# Altium schematic sheet Nixiewatch.SchDoc
size A2
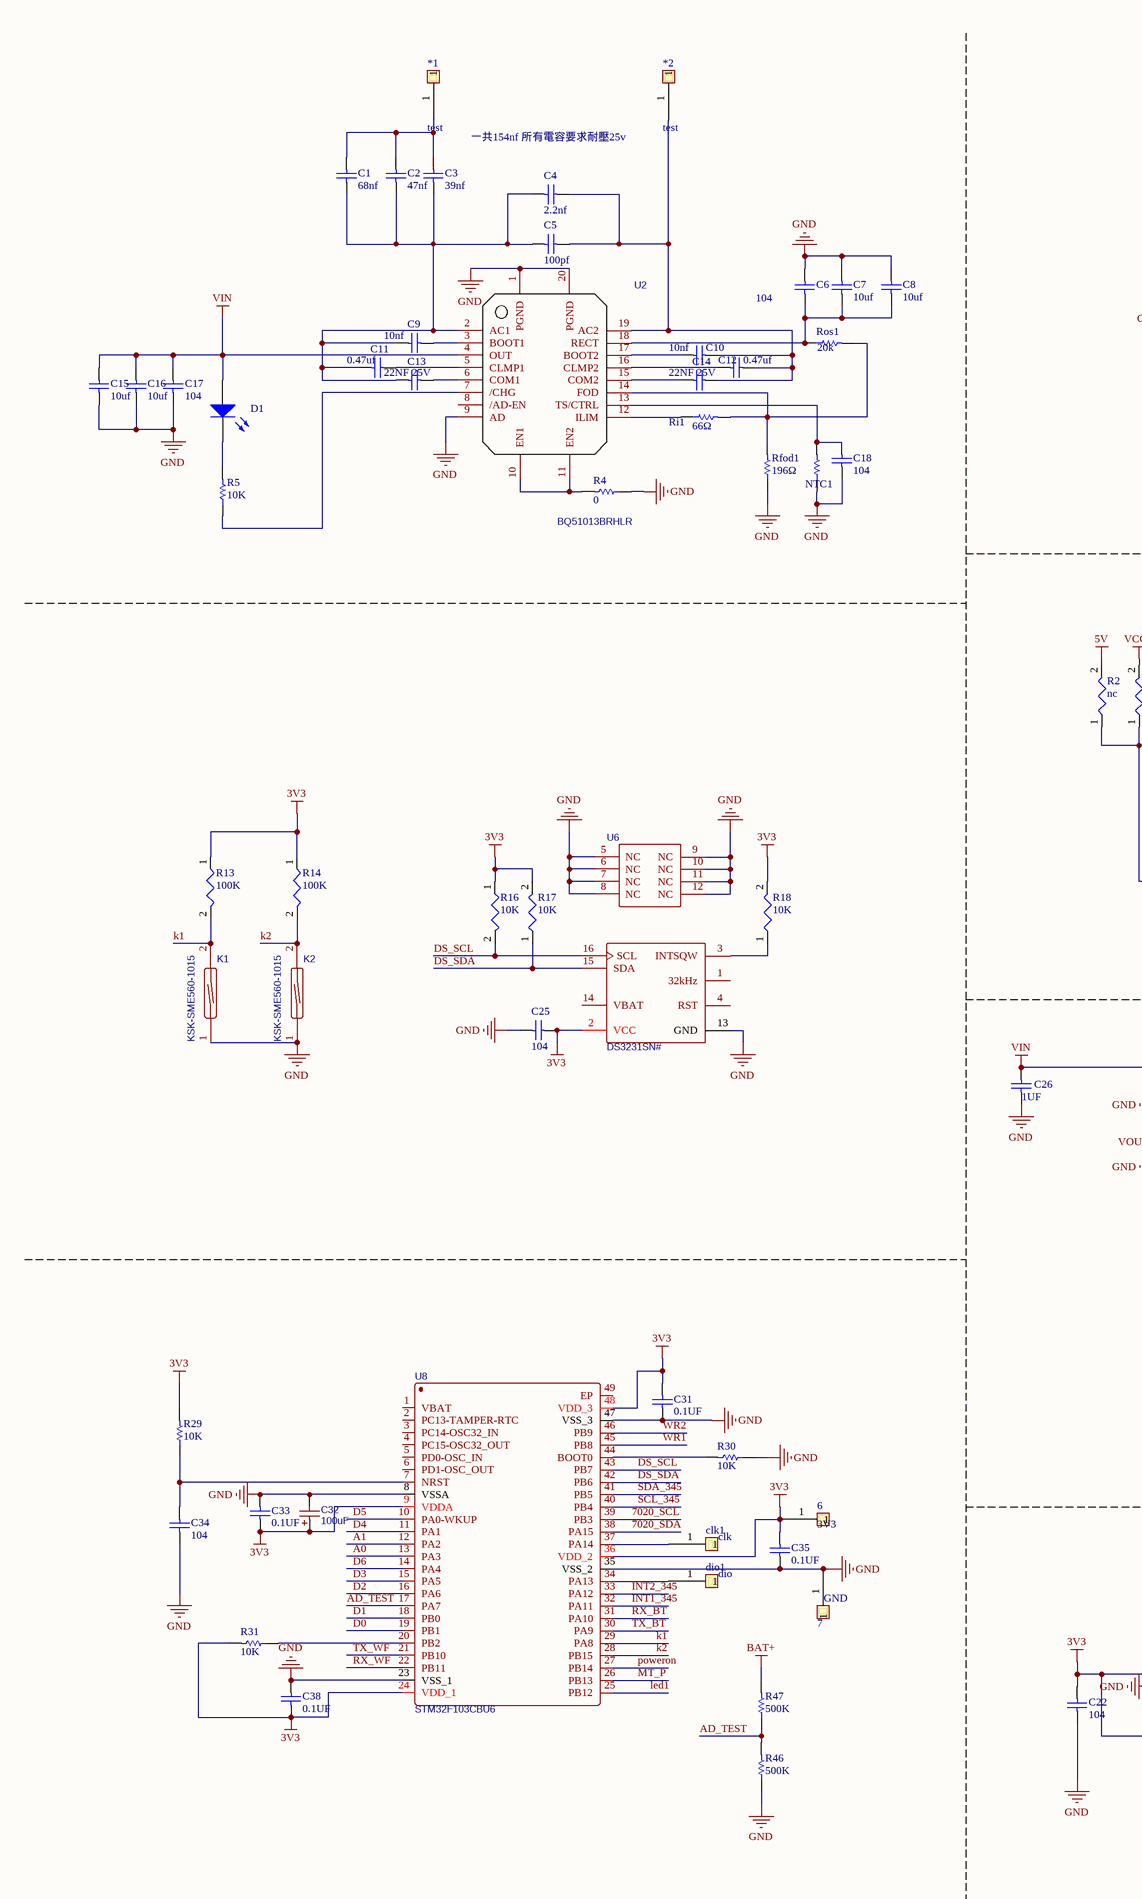
[diagram p0: Nixiewatch.SchDoc, left]
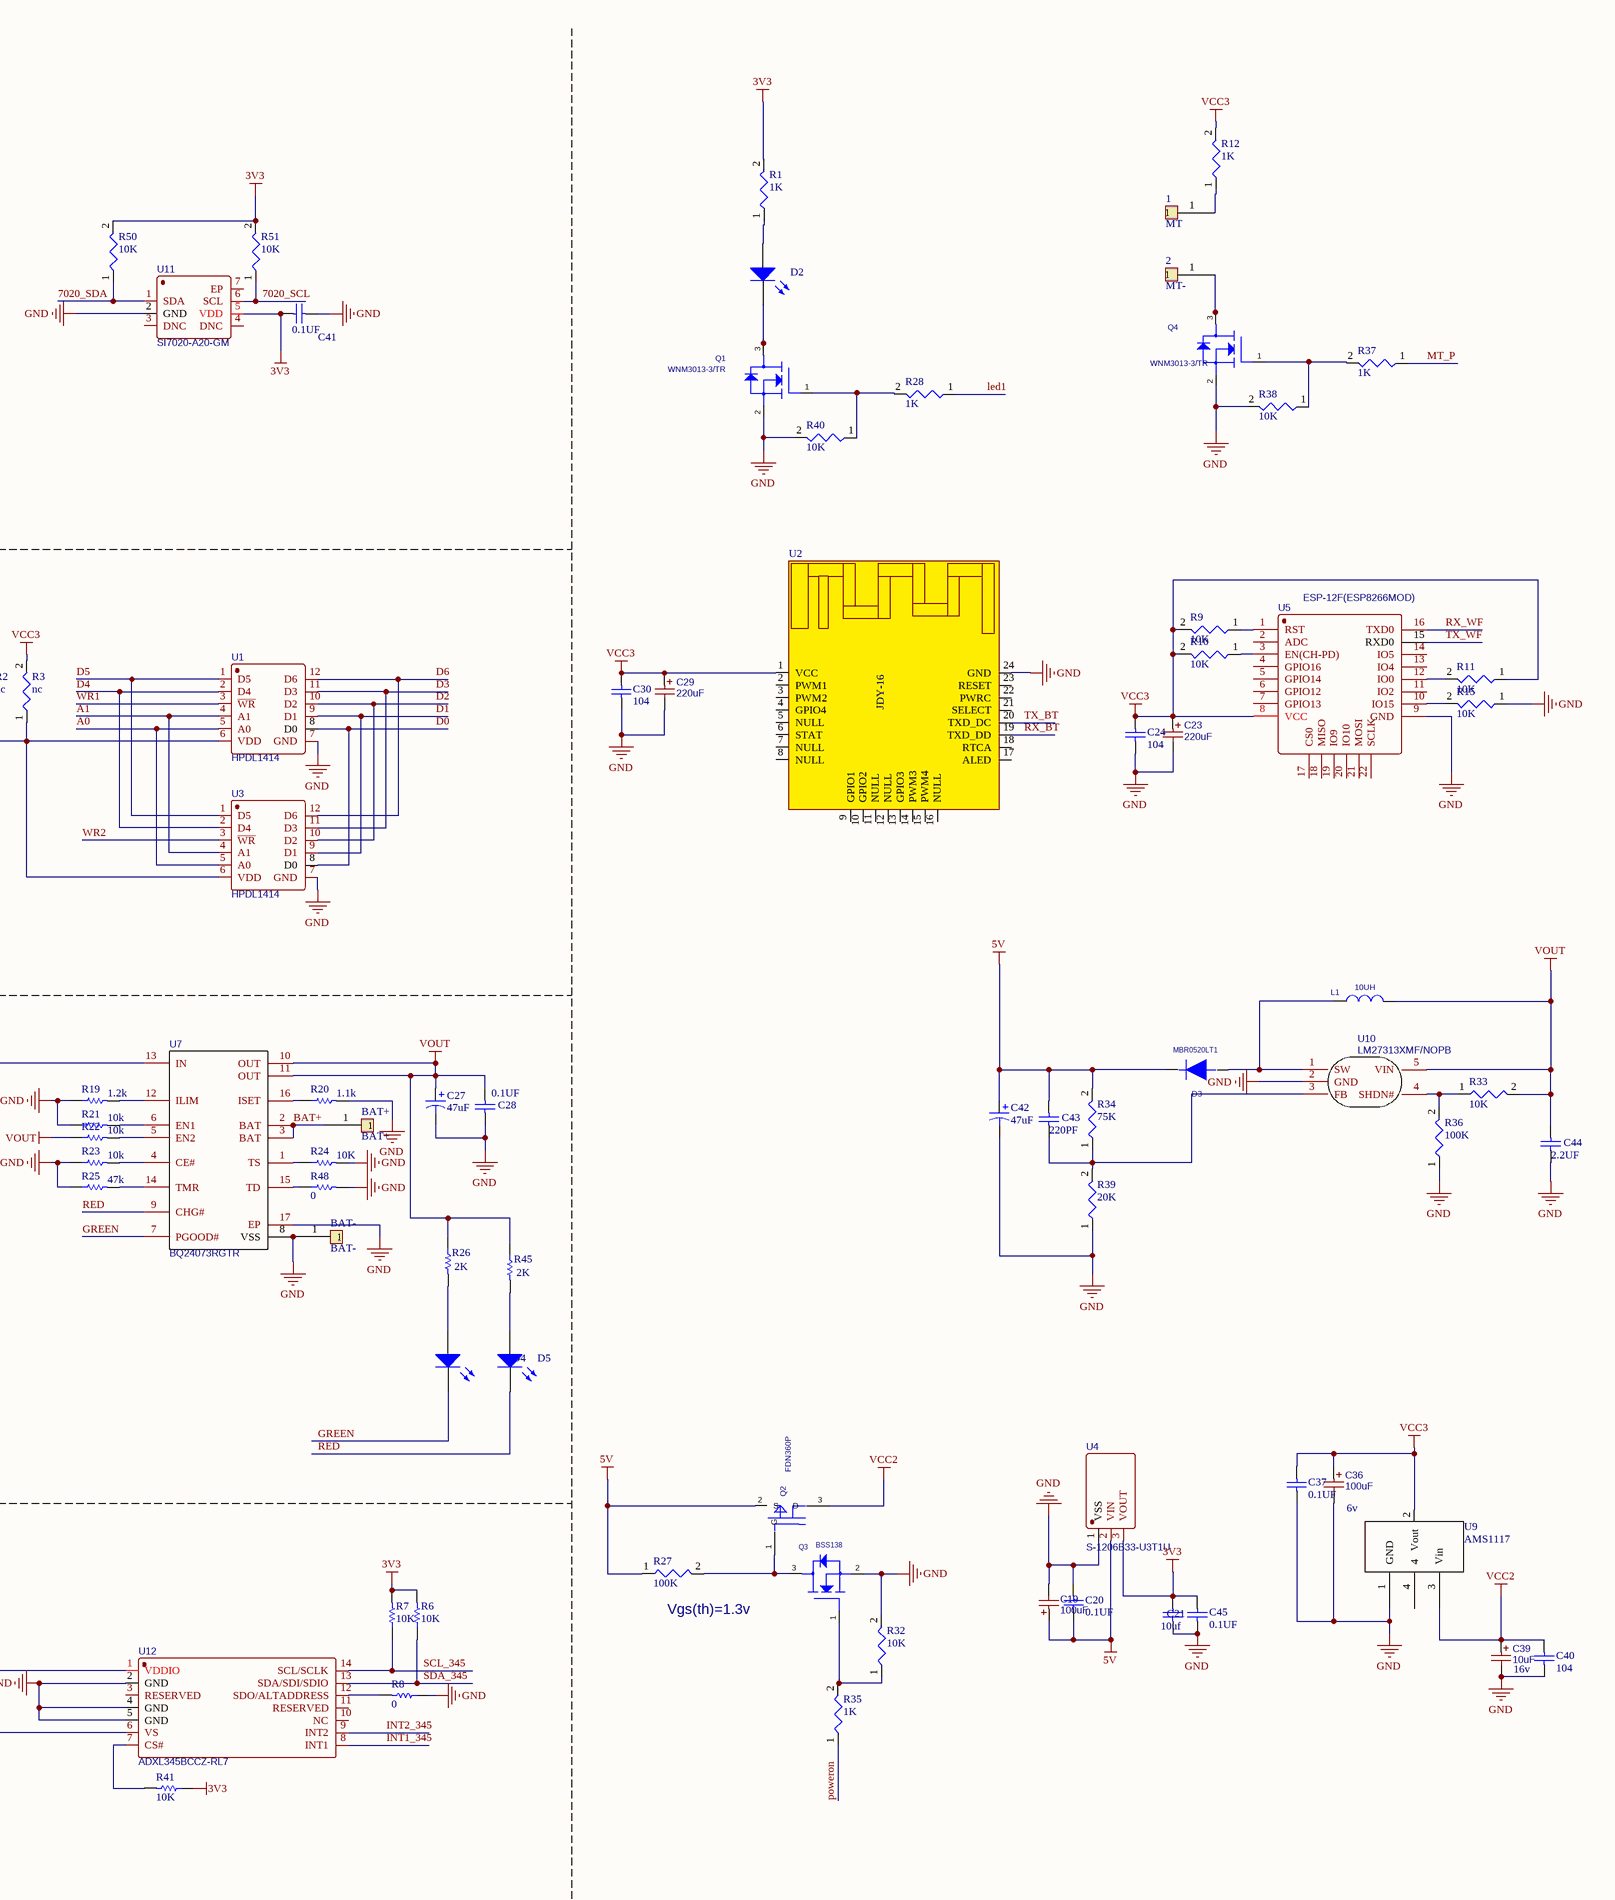
[diagram p1: Nixiewatch.SchDoc, right]

## Parts
1  MT  [测试点圆]
2  MT-  [测试点圆]
6  3V3  [测试点圆]
7  GND  [测试点圆]
*1  test  [测试点圆]
*2  test  [测试点圆]
?  U2  [JDY-16]
BAT+  BAT+  [测试点圆]
BAT-  BAT-  [测试点圆]
C1  value 68nf  [C_0402]  (hidden comment: 104)
C2  value 47nf  [C_0402]  (hidden comment: 104)
C3  value 39nf  [C_0402]  (hidden comment: 104)
C4  value 2.2nf  [C_0402]  (hidden comment: 104)
C5  value 100pf  [C0201]  (hidden comment: 104)
C6  104  [C_0402]
C7  value 10uf  [C_0402]  (hidden comment: 104)
C8  value 10uf  [C_0402]  (hidden comment: 104)
C9  value 10nf  [C_0402]  (hidden comment: 104)
C10  value 10nf  [C_0402]  (hidden comment: 104)
C11  value 0.47uf  [C_0402]  (hidden comment: 104)
C12  value 0.47uf  [C_0402]  (hidden comment: 104)
C13  value 22NF 25V  [C_0402]  (hidden comment: 104)
C14  value 22NF 25V  [C_0402]  (hidden comment: 104)
C15  value 10uf  [C_0402]  (hidden comment: 104)
C16  value 10uf  [C_0402]  (hidden comment: 104)
C17  104  [C_0402]
C18  104  [C0201]
C19  100uF  [100ufA3216]
C20  value 0.1UF  [C0201]  (hidden comment: 104)
C21  10uf  [C_0402]
C22  104  [C0201]
C23  220uF  [B3528]
C24  104  [C0201]
C25  104  [C0201]
C26  value 1UF  [C_0402]  (hidden comment: 104)
C27  value 47uF  [100ufA3216]  (hidden comment: Cap Pol1)
C28  value 0.1UF  [C0201]  (hidden comment: 104)
C29  220uF  [B3528]
C30  104  [C0201]
C31  value 0.1UF  [C0201]  (hidden comment: 104)
C32  100uF  [100ufA3216]
C33  value 0.1UF  [C0201]  (hidden comment: 104)
C34  104  [C0201]
C35  value 0.1UF  [C0201]  (hidden comment: 104)
C36  100uF  [100ufA3216]
C37  value 0.1UF  [C0201]  (hidden comment: 104)
C38  value 0.1UF  [C0201]  (hidden comment: 104)
C39  10uF  [100ufA3216]
C40  104  [C0201]
C41  value 0.1UF  [C0201]  (hidden comment: 104)
C42  value 47uF  [100ufA3216]  (hidden comment: Cap Pol1)
C43  value 220PF  [C0201]  (hidden comment: 104)
C44  value 2.2UF  [C_0402]  (hidden comment: 104)
C45  value 0.1UF  [C0201]  (hidden comment: 104)
clk1  clk  [测试点圆]
D1  LED0  [LED0402-R-RD]  (value not drawn)
D2  LED0  [LED-TH_BD3.0-P2.54-FD]  (value not drawn)
D3  MBR0520LT1  [SOD-123]
D4  LED0  [LED-TH_BD3.0-P2.54-FD]  (value not drawn)
D5  LED0  [LED0402-R-RD]  (value not drawn)
dio1  dio  [测试点圆]
K1  KSK-SME560-1015  [DIP-TH_KSK-SME560-1015]
K2  KSK-SME560-1015  [DIP-TH_KSK-SME560-1015]
L1  value 10UH  [IND_2016]  (hidden comment: 2520L_0.68UH)
NTC1  Res1  [R0201]  (value not drawn)
Q1  value WNM3013-3/TR  [SOT_723]  (hidden comment: 2N7002/SOT_1)
Q2  FDN360P  [LC-SOT-23(SOT-23-3)]
Q3  value BSS138  [BSS138]  (hidden comment: 2N7002/SOT_1)
Q4  value WNM3013-3/TR  [SOT_723]  (hidden comment: 2N7002/SOT_1)
R1  1K  [R0201]
R2  nc  [R_0402]
R3  nc  [R_0402]
R4  value 0  [R0201]  (hidden comment: Res1)
R5  value 10K  [R0201]  (hidden comment: Res1)
R6  value 10K  [R0201]  (hidden comment: Res1)
R7  value 10K  [R0201]  (hidden comment: Res1)
R8  value 0  [R0201]  (hidden comment: Res1)
R9  10K  [R0201]
R10  10K  [R0201]
R11  10K  [R0201]
R12  1K  [R0201]
R13  100K  [R0201]
R14  100K  [R0201]
R15  10K  [R0201]
R16  10K  [R0201]
R17  10K  [R0201]
R18  10K  [R0201]
R19  value 1.2k  [R0201]  (hidden comment: Res1)
R20  value 1.1k  [R0201]  (hidden comment: Res1)
R21  value 10k  [R0201]  (hidden comment: Res1)
R22  value 10k  [R0201]  (hidden comment: Res1)
R23  value 10k  [R0201]  (hidden comment: Res1)
R24  value 10K  [R0201]  (hidden comment: Res1)
R25  value 47k  [R0201]  (hidden comment: Res1)
R26  value 2K  [R0201]  (hidden comment: Res1)
R27  100K  [R0201]
R28  1K  [R0201]
R29  value 10K  [R0201]  (hidden comment: Res1)
R30  value 10K  [R0201]  (hidden comment: Res1)
R31  value 10K  [R0201]  (hidden comment: Res1)
R32  10K  [R0201]
R33  10K  [R0201]
R34  75K  [R0201]
R35  1K  [R0201]
R36  100K  [R0201]
R37  1K  [R0201]
R38  10K  [R0201]
R39  20K  [R0201]
R40  10K  [R0201]
R41  value 10K  [R0201]  (hidden comment: Res1)
R45  value 2K  [R0201]  (hidden comment: Res1)
R46  value 500K  [R0201]  (hidden comment: Res1)
R47  value 500K  [R0201]  (hidden comment: Res1)
R48  value 0  [C_0402]  (hidden comment: Res1)
R50  10K  [R0201]
R51  10K  [R0201]
Rfod1  value 196Ω  [R0201]  (hidden comment: Res1)
Ri1  value 66Ω  [R0201]  (hidden comment: Res1)
Ros1  value 20k  [R0201]  (hidden comment: Res1)
U1  HPDL1414  [HPDL1414]
U2  BQ51013BRHLR  [QFN-20_L4.7-W3.7-P0.50-BL-EP]
U3  HPDL1414  [HPDL1414]
U4  S-1206B33-U3T1U  [SOT-89-3_L4.5-W2.5-P1.50-LS4.2-TL]
U5  ESP-12F(ESP8266MOD)  [ESP-12F-ESP8266MOD]
U6  DS3231SN#  [DS3231]
U7  BQ24073RGTR  [BQ24073RGTR]
U8  STM32F103CBU6  [STM32F103CBU6]
U9  AMS1117  [SOT223 LM1117 3.3V]
U10  LM27313XMF/NOPB  [SOT-23-5_L3.0-W1.7-P0.95-LS2.8-BR]
U11  SI7020-A20-GM  [SI7020]
U12  ADXL345BCCZ-RL7  [LGA-14_L5.0-W3.0-P0.80-BL]

## Nets
3V3: 6.1 C21.1 C22.1 C25.2 C31.2 C32.1 C33.1 C35.2 C38.1 C41.1 C45.2 R1.2 R6.2 R7.2 R13.1 R14.1 R16.1 R17.2 R18.2 R29.2 R31.2 R41.1 R50.2 R51.2 U4.3(VOUT) U6.2(VCC) U8.9(VDDA) U8.24(VDD_1) U8.36(VDD_2) U8.48(VDD_3) U11.5(VDD) U12.1(VDDIO) U12.6(VS)
5V: C19.1 C20.1 C42.1 C43.1 D3.1 Q2.2(S) R2.2 R27.1 R34.2 U4.2(VIN)
BAT+: BAT+.1 R47.2 U7.2(BAT) U7.3(BAT)
GND: 7.1 ?.24(GND) BAT-.1 C6.1 C7.1 C8.1 C15.2 C16.2 C17.2 C18.2 C19.2 C20.2 C21.2 C22.2 C23.2 C24.1 C25.1 C26.2 C27.2 C28.2 C29.2 C30.1 C31.1 C32.2 C33.2 C34.2 C35.1 C36.2 C37.1 C38.2 C39.2 C40.1 C41.2 C42.2 C44.2 C45.1 K1.1 K2.1 NTC1.1 Q1.2(SOURCE) Q3.2(SOURCE) Q4.2(SOURCE) R4.1 R8.1 R15.1 R19.1 R20.2 R21.1 R23.1 R24.2 R25.1 R30.1 R32.2 R36.1 R38.2 R39.1 R40.2 R46.1 R48.2 Rfod1.1 U1.7(GND) U2.1(PGND) U2.9(AD) U2.20(PGND) U3.7(GND) U4.1(VSS) U5.9(GND) U6.5(NC) U6.6(NC) U6.7(NC) U6.8(NC) U6.9(NC) U6.10(NC) U6.11(NC) U6.12(NC) U6.13(GND) U7.8(VSS) U7.17(EP) U8.8(VSSA) U8.23(VSS_1) U8.35(VSS_2) U8.47(VSS_3) U9.1(GND) U10.2(GND) U11.2(GND) U12.2(GND) U12.4(GND) U12.5(GND)
VCC2: C39.1 C40.2 Q2.3(D) U9.3(Vin)
VCC3: ?.1(VCC) C23.1 C24.2 C29.1 C30.2 C36.1 C37.2 R3.2 R9.2 R10.2 R11.1 R12.2 U5.8(VCC) U9.2(Vout)
VIN: C15.1 C16.1 C17.1 C26.1 D1.1(A) U2.4(OUT) U7.13(IN)
VOUT: C27.1 C28.1 C44.1 L1.2 R22.1 R26.1 R33.2 R45.1 U7.10(OUT) U7.11(OUT) U10.5(VIN)
7020_SCL: R51.1 U8.39(PB3) U11.6(SCL)
7020_SDA: R50.1 U8.38(PA15) U11.1(SDA)
A0: U1.5(A0) U3.5(A0) U8.13(PA3)
A1: U1.4(A1) U3.4(A1) U8.12(PA2)
AD_TEST: R46.2 R47.1 U8.17(PA7)
D0: U1.8(D0) U3.8(D0) U8.19(PB1)
D1: U1.9(D1) U3.9(D1) U8.18(PB0)
D2: U1.10(D2) U3.10(D2) U8.16(PA6)
D3: U1.11(D3) U3.11(D3) U8.15(PA5)
D4: U1.2(D4) U3.2(D4) U8.11(PA1)
D5: U1.1(D5) U3.1(D5) U8.10(PA0-WKUP)
D6: U1.12(D6) U3.12(D6) U8.14(PA4)
DS_SCL: R16.2 U6.16(SCL) U8.43(PB7)
DS_SDA: R17.1 U6.15(SDA) U8.42(PB6)
GREEN: D4.2(K) U7.7(PGOOD#)
INT1_345: U8.32(PA11) U12.8(INT1)
INT2_345: U8.33(PA12) U12.9(INT2)
k1: K1.2 R13.2 U8.29(PA8)
k2: K2.2 R14.2 U8.28(PB15)
led1: R28.1 U8.25(PB12)
MT_P: R37.1 U8.26(PB13)
poweron: R35.1 U8.27(PB14)
RED: D5.2(K) U7.9(CHG#)
RX_BT: ?.19(TXD_DD) U8.31(PA10)
RX_WF: U5.16(TXD0) U8.22(PB11)
SCL_345: R7.1 U8.40(PB4) U12.14(SCL/SCLK)
SDA_345: R6.1 U8.41(PB5) U12.13(SDA/SDI/SDIO)
TX_BT: ?.20(TXD_DC) U8.30(PA9)
TX_WF: U5.15(RXD0) U8.21(PB10)
WR1: U1.3(~{WR}) U8.45(PB8)
WR2: U3.3(~{WR}) U8.46(PB9)
Net1_1: 1.1 R12.1
Net2_1: 2.1 Q4.3(DRAIN)
Net*1_1: *1.1 C1.1 C2.1 C3.1
Net*2_1: *2.1 C4.1 C5.1 C10.1 C12.1 C14.1 U2.19(AC2)
NetC1_2: C1.2 C2.2 C3.2 C4.2 C5.2 C9.2 C11.2 C13.2 U2.2(AC1)
NetC6_2: C6.2 C7.2 C8.2 Ros1.1 U2.18(RECT)
NetC9_1: C9.1 U2.3(BOOT1)
NetC10_2: C10.2 U2.17(BOOT2)
NetC11_1: C11.1 U2.5(CLMP1)
NetC12_2: C12.2 U2.16(CLMP2)
NetC13_1: C13.1 U2.6(COM1)
NetC14_2: C14.2 U2.15(COM2)
NetC18_1: C18.1 NTC1.2 U2.13(TS/CTRL)
NetC34_1: C34.1 R29.1 U8.7(NRST)
NetC43_2: C43.2 R34.1 R39.2 U10.3(FB)
Netclk1_1: clk1.1 U8.37(PA14)
NetD1_2: D1.2(K) R5.2
NetD2_1: D2.1(A) R1.1
NetD2_2: D2.2(K) Q1.3(DRAIN)
NetD3_2: D3.2 L1.1 U10.1(SW)
NetD4_1: D4.1(A) R26.2
NetD5_1: D5.1(A) R45.2
Netdio1_1: dio1.1 U8.34(PA13)
NetQ1_1: Q1.1(GATE) R28.2 R40.1
NetQ2_1: Q2.1(G) Q3.3(DRAIN) R27.2
NetQ3_1: Q3.1(GATE) R32.1 R35.2
NetQ4_1: Q4.1(GATE) R37.2 R38.1
NetR2_1: R2.1 R3.1 U1.6(VDD) U3.6(VDD)
NetR4_2: R4.2 U2.10(EN1) U2.11(EN2)
NetR5_1: R5.1 U2.7(/CHG)
NetR8_2: R8.2 U12.12(SDO/ALTADDRESS)
NetR9_1: R9.1 U5.1(RST)
NetR10_1: R10.1 U5.3(EN(CH-PD))
NetR11_2: R11.2 U5.12(IO0)
NetR15_2: R15.2 U5.10(IO15)
NetR18_1: R18.1 U6.3(INTSQW)
NetR19_2: R19.2 U7.12(ILIM)
NetR20_1: R20.1 U7.16(ISET)
NetR21_2: R21.2 U7.6(EN1)
NetR22_2: R22.2 U7.5(EN2)
NetR23_2: R23.2 U7.4(CE#)
NetR24_1: R24.1 U7.1(TS)
NetR25_2: R25.2 U7.14(TMR)
NetR30_2: R30.2 U8.44(BOOT0)
NetR31_1: R31.1 U8.20(PB2)
NetR33_1: R33.1 R36.2 U10.4(SHDN#)
NetR41_2: R41.2 U12.7(CS#)
NetR48_1: R48.1 U7.15(TD)
NetRfod1_2: Rfod1.2 Ri1.2 Ros1.2 U2.14(FOD)
NetRi1_1: Ri1.1 U2.12(ILIM)

Not connected (* = marked no-connect by the designer): ? 2(PWM1) 3(PWM2) 4(GPIO4) 5(NULL) 6(STAT) 7(NULL) 8(NULL) 9(GPIO1) 10(GPIO2) 11(NULL) 12(NULL) 13(GPIO3) 14(PWM3) 15(PWM4) 16(NULL) 17(ALED) 18(RTCA) 21(SELECT) 22(PWRC) 23(RESET); U2 8(/AD-EN); U5 2(ADC) 4(GPIO16) 5(GPIO14) 6(GPIO12) 7(GPIO13) 11(IO2) 13(IO4) 14(IO5) 17(CS0) 18(MISO) 19(IO9) 20(IO10) 21(MOSI) 22(SCLK); U6 1(32kHz) 4(RST) 14(VBAT); U8 1(VBAT) 2(PC13-TAMPER-RTC) 3(PC14-OSC32_IN) 4(PC15-OSC32_OUT) 5(PD0-OSC_IN) 6(PD1-OSC_OUT) 49(EP); U9 4; U11 3(DNC) 4(DNC) 7(EP); U12 3(RESERVED) 10(NC) 11(RESERVED)

## Notes on the sheet
- 一共154nf 所有電容要求耐壓25v
- (near C36) 6v
- (near R27) Vgs(th)=1.3v
- 16v
- Title
- Size:
- Date:
- File:
- A2
- Number:
- Time:
- Revision:
- Sheet
- of
- (in symbol CC2541-MOD) JDY-16

## Library data of the parts
1 2 6 7 BAT+ BAT- clk1 dio1 = test
? = CC2541-MOD
C1-C18 C20-C22 C24-C26 C28 C30 C31 C33-C35 C37 C38 C40 C41 C43-C45 = Cap: Capacitor; Published: 8-Jun-2000; LatestRevisionDate: 17-Jul-2002; LatestRevisionNote: Re-released for DXP Platform.; PackageReference: RAD-0.3; Publisher: Altium Limited; PackageDescription: Radial Cap, Thru-Hole; 2 Leads; 0.3 in Pin Spacing
  C6 C17 C18 C22 C24 C25 C30 C34 C40: Value: 104
  C21: Value: 10uf
C19 C23 C29 C32 C36 C39 = 22uF: BOM_Manufacturer: Sunlord; BOM_Manufacturer Part: TC212A226K010A; nameAlias: Capacitance; Contributor: LCSC; SMT Type: Extend; BOM_Supplier: LCSC; BOM_Supplier Part: C123296; BOM_LCSC Assembly: Yes; spicePre: C; spiceSymbolName: TC212A226K010A
C27 C42 = Cap Pol1: Polarized Capacitor (Radial); Published: 8-Jun-2000; LatestRevisionDate: 17-Jul-2002; LatestRevisionNote: Re-released for DXP Platform.; PackageReference: RB7.6-15; Publisher: Altium Limited; PackageDescription: Polarized Capacitor (Radial); 2 Leads
D1 D2 D4 D5 = LED0: Typical INFRARED GaAs LED; Published: 8-Jun-2000; LatestRevisionDate: 08-Jul-2005; LatestRevisionNote: Mech Layer 1 removed.; PackageReference: LED-0; Publisher: Altium Limited; PackageDescription: LED; 2 Leads
D3 = MBR0520LT1: Manufacturer #1: ON; ASSEMBLY: SMT; Geometry Height: 2.5MM; Geometry.Height: 1.35mm; R3 Number: HV1000101; PCB DECAL: SOD-123; Value: MBR0520LT1; Part Number: MBR0520LT1; Manufacturer: ON
K1 K2 = KSK-SME560-1015: BOM_Manufacturer: STANDEXMEDER; Contributor: LCSC; BOM_Supplier: LCSC; BOM_Supplier Part: C575284; BOM_Manufacturer Part: KSK-SME560-1015; spicePre: K; spiceSymbolName: KSK-SME560-1015
L1 = 2520L_0.68UH: Power Inductor,22uH,+/-20%,2520; Manufacturer: TDK; Part Number: SWPA252012S220MT; R3 Number: HL900226M; ASSEMBLY: SMT; Geometry.Height: 1.1MM; PCB DECAL: IND_2016
NTC1 R4-R8 R19-R26 R29-R31 R41 R45-R48 Rfod1 Ri1 Ros1 = Res1: Resistor; Published: 8-Jun-2000; LatestRevisionDate: 17-Jul-2002; LatestRevisionNote: Re-released for DXP Platform.; PackageReference: AXIAL-0.3; Publisher: Altium Limited; PackageDescription: Axial Device, Thru-Hole; 2 Leads; 0.3 in Pin Spacing
Q1 Q4 = 2N7002/SOT_1: WILL WNM3013  N-Channel MOSFET 30V, 0.10A, SOT-723; Geometry.Height: 0.5MM; R3 Number: HD1003013; PCB DECAL: SOT_723; Manufacturer: WILL; Part Number: WNM3013-3/TR
Q2 = FDN360P: n-mos; Part Number: BSS138; Manufacturer #1: infineon; Geometry.Height: 1.3mm; PCB DECAL: LC-SOT-23(SOT-23-3)
Q3 = 2N7002/SOT_1: WILL WNM3013  N-Channel MOSFET 30V, 0.10A, SOT-723; Part Number: WNM3013-3/TR; Geometry.Height: 0.5MM; R3 Number: HD1003013; PCB DECAL: BSS138; Manufacturer: WILL
R1-R3 R9-R18 R27 R28 R32-R40 R50 R51 = ?K
U1 U3 = HPDL1414: BOM_Manufacturer: TI; BOM_Manufacturer Part: SN74LS145DR; SMT Type: Extend; BOM_Supplier: LCSC; BOM_Supplier Part: C60829; BOM_LCSC Assembly: Yes; spicePre: U
U2 = BQ51013BRHLR: BOM_Manufacturer: TI; SMT Type: Extend; BOM_Supplier: LCSC; BOM_Manufacturer Part: BQ51013BRHLR; image: //image.lceda.cn/szlcsc/C55663.jpg; BOM_Supplier Part: C55663; BOM_LCSC Assembly: Yes; spicePre: U; spiceSymbolName: BQ51013BRHLR
U4 = S-1206B33-U3T1U: BOM_Manufacturer: SEIKO; Current - Output: 250mA; Voltage - Input (Max): 6.5V; Contributor: LCSC; SMT Type: Extend; BOM_Supplier: LCSC; BOM_Manufacturer Part: S-1206B33-U3T1U; BOM_Supplier Part: C155188; BOM_LCSC Assembly: Yes; spicePre: U; spiceSymbolName: S-1206B33-U3T1U
U5 = ESP-12F(ESP8266MOD): BOM_Manufacturer: Ai-Thinker; BOM_Supplier: LCSC; BOM_Manufacturer Part: ESP-12F(ESP8266MOD); BOM_Supplier Part: C82891; spicePre: U; spiceSymbolName: ESP-12F(ESP8266MOD)
U6 = DS3231SN#: BOM_Manufacturer: MAXIM; subpart_no: 1; tags: Clock; BOM_Supplier Part: C9866; BOM_Supplier: LCSC; BOM_Manufacturer Part: DS3231SN; image: http://image.lceda.cn/szlcsc/C9866.jpg; spicePre: U
U7 = BQ24073RGTR: BOM_Manufacturer: TI; SMT Type: Extend; BOM_Supplier: LCSC; BOM_Manufacturer Part: BQ24073RGTR; image: //image.lceda.cn/szlcsc/C15220.jpg; BOM_Supplier Part: C15220; BOM_LCSC Assembly: Yes; spicePre: U; spiceSymbolName: BQ24073RGTR
U8 = STM32F103CBU6: BOM_Manufacturer: ST; subpart_no: 1; tags: STM32; SMT Type: Extend; BOM_Supplier Part: C55506; BOM_Supplier: LCSC; BOM_Manufacturer Part: STM32F103CBU6; BOM_LCSC Assembly: Yes; spicePre: U; spiceSymbolName: STM32F103CBU6
U10 = LM27313XMF/NOPB: BOM_Manufacturer: TI; SMT Type: Extend; BOM_Supplier: LCSC; BOM_Manufacturer Part: LM27313XMF/NOPB; image: //image.lceda.cn/szlcsc/C32355.jpg; BOM_Supplier Part: C32355; BOM_LCSC Assembly: Yes; spicePre: U; spiceSymbolName: LM27313XMF/NOPB
U11 = SI7020-A20-GM: BOM_Manufacturer: SILICON LABS; Contributor: LCSC; BOM_Supplier: LCSC; BOM_Supplier Part: C430228; BOM_Manufacturer Part: SI7020-A20-GM; spicePre: U; spiceSymbolName: SI7020-A20-GM
U12 = ADXL345BCCZ-RL7: BOM_Manufacturer: ADI; SMT Type: Extend; BOM_Supplier: LCSC; BOM_Manufacturer Part: ADXL345BCCZ-RL7; image: //image.lceda.cn/szlcsc/C9667.jpg; BOM_Supplier Part: C9667; BOM_LCSC Assembly: Yes; spicePre: U; spiceSymbolName: ADXL345BCCZ-RL7